# EAGLE design fonte (EAGLE 9.6.2)
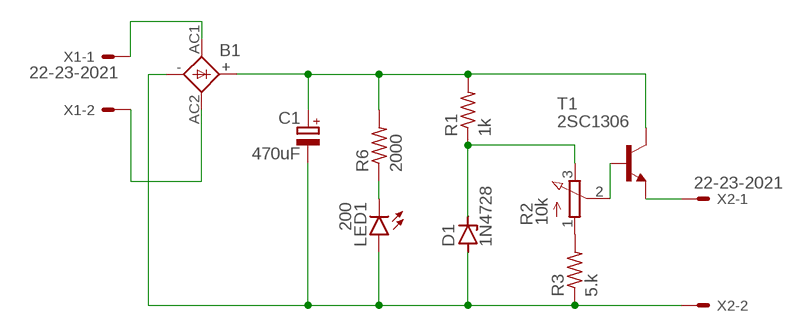
[diagram p0: schematic, sheet 1]

## Parts
B1  GBPC1  [GBPC1]
C1  470uF  CPOL-EUB45181B  [B45181B]
D1  1N4728  [DO41Z10]
LED1  200  LED3MM  [LED3MM]
R1  1k  R-US_0204/7  [0204/7]
R2  10k  3RP/1610N  [3RP/1610N]
R3  5.k  R-US_0204/7  [0204/7]
R6  2000  R-US_0204/7  [0204/7]
T1  2SC1306  [TO220BV]
X1  22-23-2021  [22-23-2021]
X2  22-23-2021  [22-23-2021]

## Nets
N$3: B1.AC1 X1.1
N$4: B1.AC2 X1.2
N$5: B1.- C1.- D1.A LED1.A R3.1 X2.2
N$6: B1.+ C1.+ R1.2 R6.2 T1.2(C)
N$7: D1.C R1.1 R2.3(E)
N$8: R2.1(A) R3.2
N$9: R2.2(S) T1.1(B)
N$11: T1.3(E) X2.1
N$12: LED1.K(C) R6.1

## Library data of the parts
B1 = rectifier:GBPC1: GENERAL INSTRUMENT RECTIFIER
C1 = rcl:CPOL-EU: POLARIZED CAPACITOR, European symbol; SPICEPREFIX: C
D1 = diode:1N4728: Z DIODE 3.3 V, 1W, 5 percent
LED1 = led:LED: LED OSRAM: - CHIPLED LG R971, LG N971, LY N971, LG Q971, LY Q971, LO R971, LY R971 LH N974, LH R974 LS Q976, LO Q976, LY Q976 LO Q996 - Hyper CHIPLED LW Q18S LB Q993, LB Q99A, LB R99A - SideLED LS A670, LO A670, LY A670, LG A670, LP A670 LB A673, LV A673, LT A673, LW A673 LH A674 LY A675 LS A676, LA A676, LO A676, LY A676, LW A676 LS A679, LY A679, LG A679 - Hyper Micro SIDELED® LS Y876, LA Y876, LO Y876, LY Y876 LT Y87S - SmartLED LW L88C, LW L88S LB L89C, LB L89S, LG L890 LS L89K, LO L89K, LY L89K LS L896, LA L896, LO L896, LY L896 - TOPLED LS T670, LO T670, LY T670, LG T670, LP T670 LSG T670, LSP T670, LSY T670, LOP T670, LYG T670 LG T671, LOG T671, LSG T671 LB T673, LV T673, LT T673, LW T673 LH T674 LS T676, LA T676, LO T676, LY T676, LB T676, LH T676, LSB T676, LW T676 LB T67C, LV T67C, LT T67C, LS T67K, LO T67K, LY T67K, LW E67C LS E67B, LA E67B, LO E67B, LY E67B, LB E67C, LV E67C, LT E67C LW T67C LS T679, LY T679, LG T679 LS T770, LO T770, LY T770, LG T770, LP T770 LB T773, LV T773, LT T773, LW T773 LH T774 LS E675, LA E675, LY E675, LS T675 LS T776, LA T776, LO T776, LY T776, LB T776 LHGB T686 LT T68C, LB T68C - Hyper Mini TOPLED® LB M676 - Mini TOPLED Santana® LG M470 LS M47K, LO M47K, LY M47K Source: http://www.osram.convergy.de LUXEON: - LUMILED® LXK2-PW12-R00, LXK2-PW12-S00, LXK2-PW14-U00, LXK2-PW14-V00 LXK2-PM12-R00, LXK2-PM12-S00, LXK2-PM14-U00 LXK2-PE12-Q00, LXK2-PE12-R00, LXK2-PE12-S00, LXK2-PE14-T00, LXK2-PE14-U00 LXK2-PB12-K00, LXK2-PB12-L00, LXK2-PB12-M00, LXK2-PB14-N00, LXK2-PB14-P00, LXK2-PB14-Q00 LXK2-PR12-L00, LXK2-PR12-M00, LXK2-PR14-Q00, LXK2-PR14-R00 LXK2-PD12-Q00, LXK2-PD12-R00, LXK2-PD12-S00 LXK2-PH12-R00, LXK2-PH12-S00 LXK2-PL12-P00, LXK2-PL12-Q00, LXK2-PL12-R00 Source: www.luxeon.com KINGBRIGHT: KA-3528ASYC Source: www.kingbright.com
R1 R3 R6 = rcl:R-US_: RESISTOR, American symbol; SPICEPREFIX: R
R2 = pot:3RP/1610N: 16mm Potentiometer one level Source: http://www.alphapotentiometers.net/html/16mm_pot_2.html
T1 = transistor:2SC1306: NPN Transistor Final RF Power Outupt Source: 2sc1306.pdf
X1 X2 = con-molex:22-23-2021: .100" (2.54mm) Center Header - 2 Pin; MF: MOLEX; MPN: 22-23-2021; OC_FARNELL: 1462926; OC_NEWARK: 25C3832

## Board
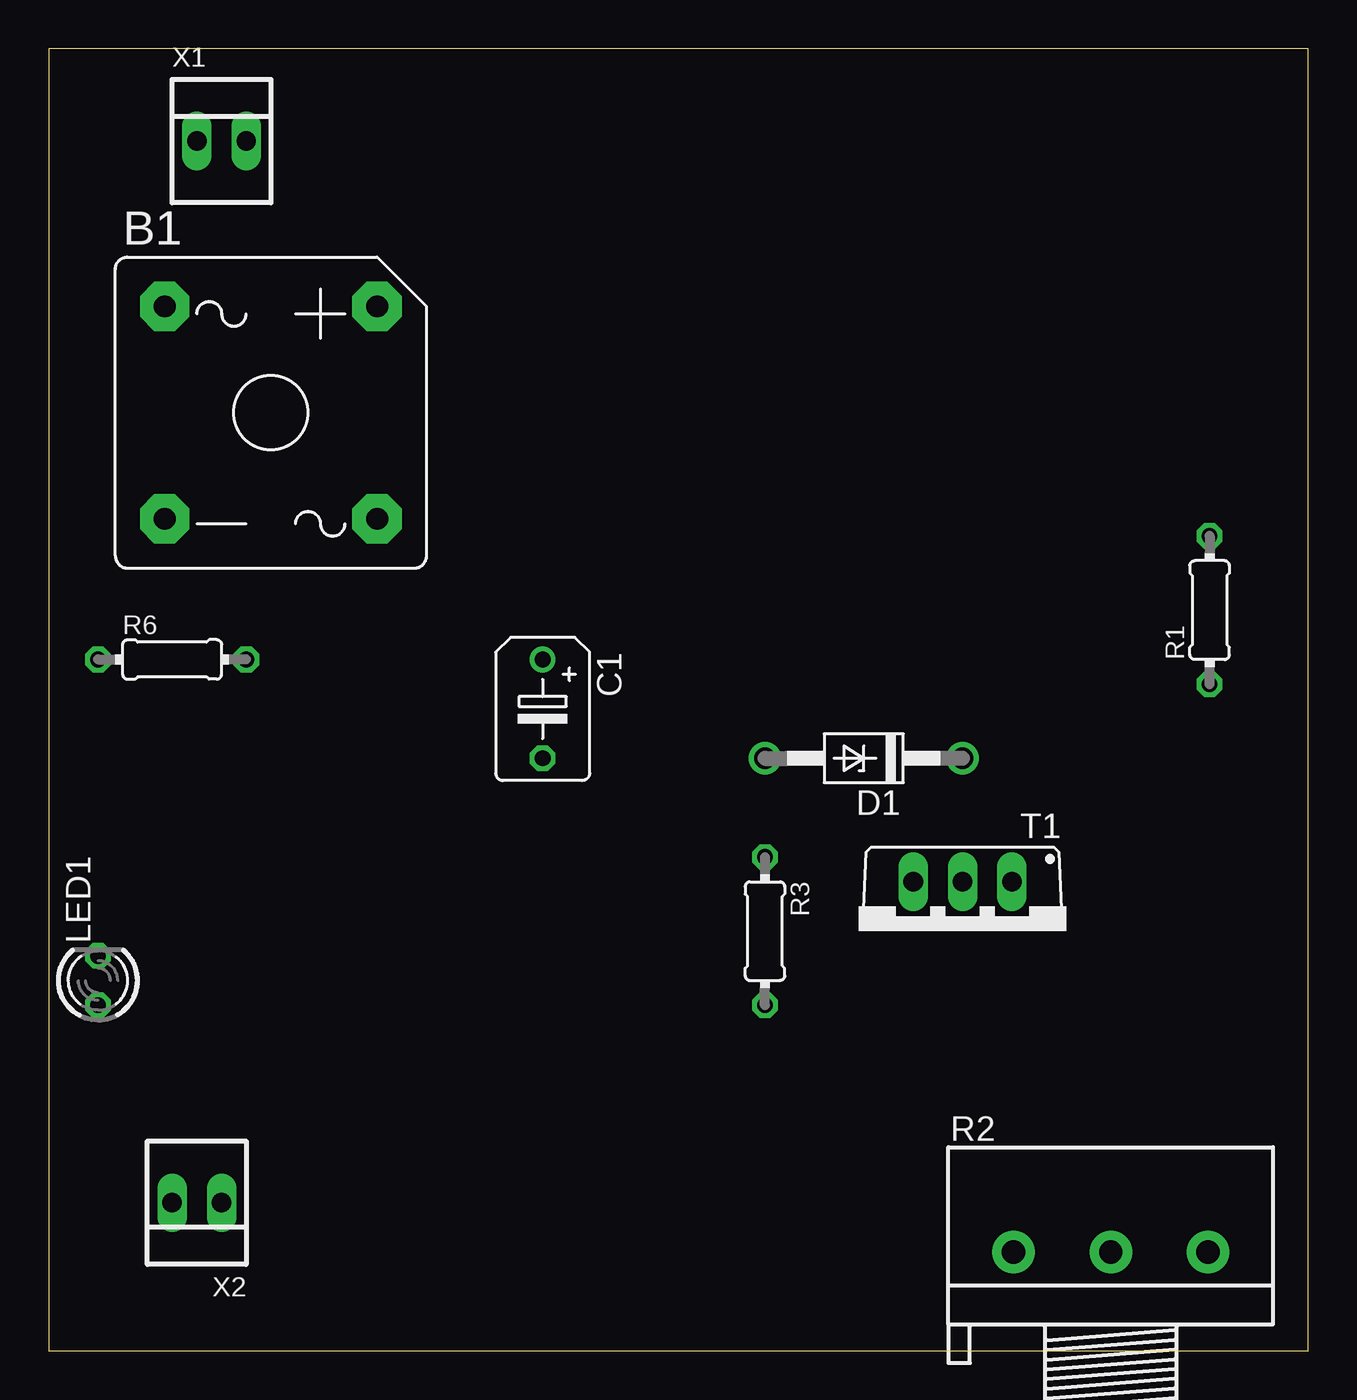
[diagram p1: board, top side]
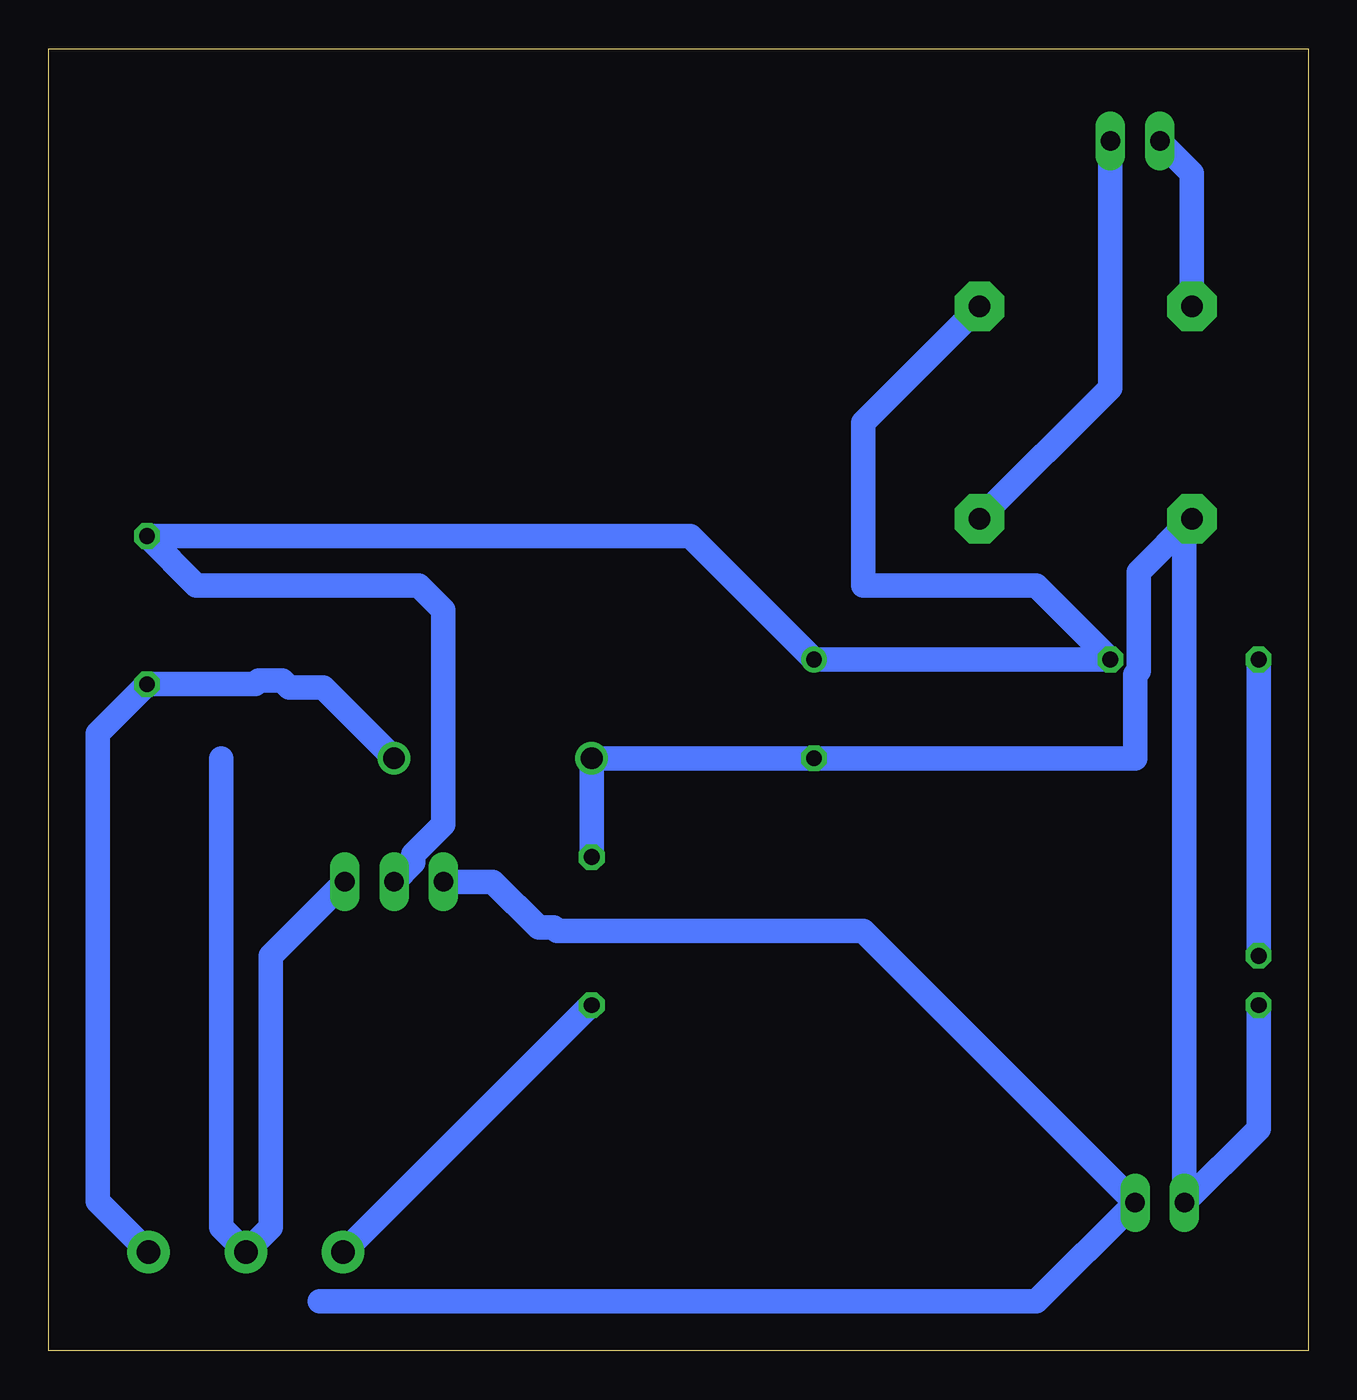
[diagram p2: board, bottom side, seen from below]

Size 64.75 x 66.98 mm. Coordinates in mm from the lower left corner, seen from the top.
Outline: 0,0 64.75,0 64.75,66.98 0,66.98 0,0
Copper layers (1*16): Top 0.035mm / dielectric 1.5mm / Bottom 0.035mm
Design rules "default": minimum track width 6mil, minimum drill 0.35mm, track to track 6mil, track to pad 6mil, pad to pad 6mil, via to via 6mil, smd to smd 6mil, copper to edge 40mil, drill to drill 6mil, minimum pad ring 10mil, minimum via ring 8mil, stop-mask expansion 4mil, vias tented up to drill 0mil, thermal gap 10mil

### Footprints (pad centres in the part's own frame; a part is rotated, then mirrored left to right if it is on the bottom)
GBPC1 = drill 1.118 pad 2.54 octagon: + 5.461,5.461; - -5.461,-5.461; AC1 -5.461,5.461; AC2 5.461,-5.461
B45181B = drill 0.813: + -2.54,0 | drill 0.813 octagon: - 2.54,0
DO41Z10 = drill 1.118: A 5.08,0; C -5.08,0
LED3MM = drill 0.813 octagon: A -1.27,0; K 1.27,0
0204/7 = drill 0.813 octagon: 1 -3.81,0; 2 3.81,0
3RP/1610N = drill 1.2 pad 2.184: 1 -5,0; 2 0,0; 3 5,0
TO220BV = drill 1.016 long: 1 -2.54,-2.54; 2 0,-2.54; 3 2.54,-2.54
22-23-2021 = drill 1 long: 1 -1.27,0; 2 1.27,0

### Placement (x,y rotation side)
B1  11.43,48.26 0 top
C1  25.4,33.02 270 top
D1  41.91,30.48 180 top
LED1  2.54,19.05 90 top
R1  59.69,38.1 90 top
R2  54.61,5.08 0 top
R3  36.83,21.59 270 top
R6  6.35,35.56 0 top
T1  46.99,21.59 180 top
X1  8.89,62.23 0 top
X2  7.62,7.62 180 top

### Tracks (layer width: path | path; a pad name or v marks a point on that pad's centre or on a via)
N$3
  Bottom 1.27: B1.AC1 5.97,60.58 X1.1
N$4
  Bottom 1.27: B1.AC2 10.16,49.53 X1.2
N$5
  Bottom 1.27: LED1.A 2.54,11.43 X2.2 6.35,42.42 B1.- 8.71,40.06 8.71,34.96 8.89,34.78 8.89,30.48 C1.- D1.A R3.1
N$6
  Bottom 1.27: R6.2 C1.+ 31.75,41.91 R1.2 57.15,39.37 45.72,39.37 44.45,38.1 44.45,27.08 46,25.53 46,25.12 T1.2 | R6.2 11.43,35.56 | R6.2 13.97,39.37 22.86,39.37 22.86,47.75 B1.+
N$7
  Bottom 1.27: R2.3 62.23,7.7 62.23,31.75 R1.1 54.12,34.29 53.94,34.47 52.74,34.47 52.38,34.11 50.62,34.11 D1.C
N$8
  Bottom 1.27: R2.1 36.91,17.78 R3.2
N$9
  Bottom 1.27: 55.88,30.48 55.88,6.35 R2.2 53.34,6.35 53.34,20.32 T1.1
N$11
  Bottom 1.27: 50.8,2.54 13.97,2.54 X2.1 22.86,21.59 38.59,21.59 38.77,21.77 39.55,21.77 41.91,24.13 T1.3
N$12
  Bottom 1.27: LED1.K R6.1